# Altium project FAN_PCB(26Pin).PrjPcb
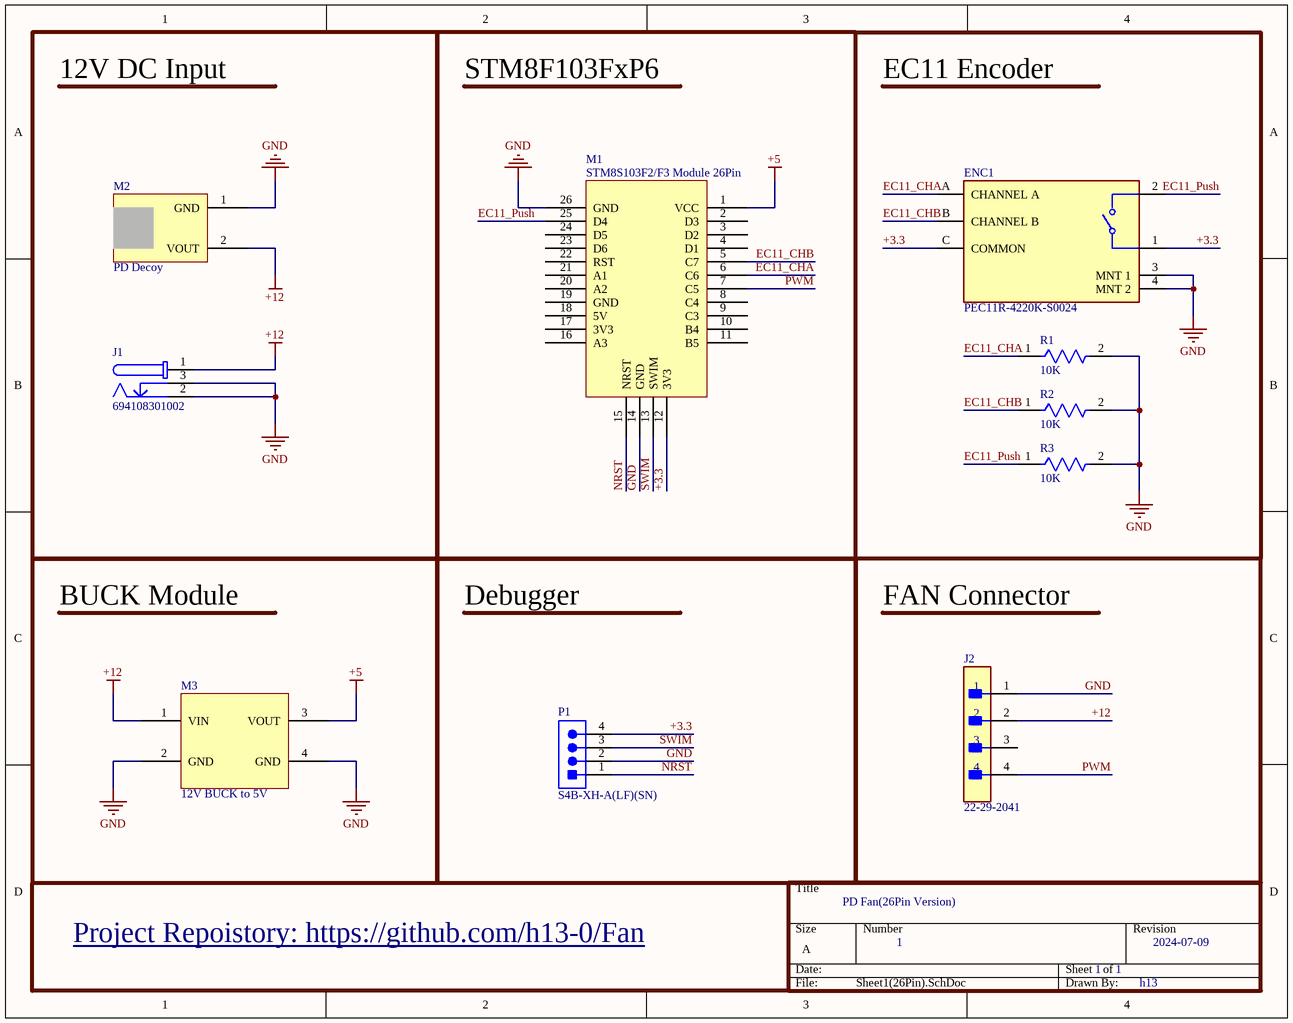
[diagram p0: Sheet1(26Pin).SchDoc]
1 sheet, 10 parts. Net scope: global (net labels, ports and power ports of the same name join across sheets).
Board file: PCB1(26Pin).PcbDoc

## Sheet Sheet1(26Pin).SchDoc
size A; SheetNumber: 1; SheetTotal: 1

### Parts
ENC1  PEC11R-4220K-S0024  [EC11]
J1  694108301002  [694108301002]
J2  22-29-2041  [FP-22-29-2041-MFG]
M1  STM8S103F2/F3 Module 26Pin  [STM8FxP6 Module 26Pin]
M2  PD Decoy  [PD Decoy]
M3  12V BUCK to 5V  [Buck Mini]
P1  S4B-XH-A(LF)(SN)  [JST-S4B-XH-A(LF)(SN)_V]
R1  10K  [FP-MRS25-MFG]
R2  10K  [FP-MRS25-MFG]
R3  10K  [FP-MRS25-MFG]

### Blocks framed on the sheet
12V DC Input: J1 M2
STM8F103FxP6: M1
EC11 Encoder: ENC1 R1-R3
BUCK Module: M3
Debugger: P1
FAN Connector: J2

### Nets
+5: M1.1(VCC) M3.3(VOUT)
+12: J1.1 J2.2 M2.2(VOUT) M3.1(VIN)
GND: ENC1.3(MNT_1) ENC1.4(MNT_2) J1.2 J1.3 J2.1 M1.14(GND) M1.26(GND) M2.1(GND) M3.2(GND) M3.4(GND) P1.2 R1.2 R2.2 R3.2
+3.3: ENC1.1 ENC1.C(COMMON) M1.12(3V3) P1.4
EC11_CHA: ENC1.A(CHANNEL_A) M1.6(C6) R1.1
EC11_CHB: ENC1.B(CHANNEL_B) M1.5(C7) R2.1
EC11_Push: ENC1.2 M1.25(D4) R3.1
NRST: M1.15(NRST) P1.1
PWM: J2.4 M1.7(C5)
SWIM: M1.13(SWIM) P1.3

Not connected (* = marked no-connect by the designer): J2 3; M1 2(D3) 3(D2) 4(D1) 8(C4) 9(C3) 10(B4) 11(B5) 16(A3) 17(3V3) 18(5V) 19(GND) 20(A2) 21(A1) 22(RST) 23(D6) 24(D5)

### Notes on the sheet
- PD Fan(26Pin Version)
- Project Repoistory: https://github.com/h13-0/Fan <https://github.com/h13-0/Fan>
- 1
- 2024-07-09
- h13

### Library data of the parts
ENC1 = CMP-07421-000070-1: ROTARY ENCODER INCREMENTAL 24PPR; pin to pad: 1>E 2>D; Pulses per Revolution: 24; Built in Switch: Yes; Number of Channels: 2; Actuator Type: Shaft; Nominal Supply Voltage (DC): 5V; Output Type: Quadrature; Hole Diameter: 1mm; Min Operating Temperature: -30°C; REACH SVHC: No SVHC; Detent: Yes; Mount: Through Hole; Termination: PC Pin; Max Operating Temperature: 70°C; Height: 13.4mm; Length: 26.5mm; RoHS Compliant: Yes; Number of Pins: 5; Width: 12.5mm; Orientation: Vertical; Packaging: Bulk; Series: PEC11R; Encoder Type: Incremental; Package Quantity: 75
J1 = CMP-1502-00190-3: NexarPartId: 52676102; Gender: Male; Voltage Rating: 24V; Insulation Resistance: 100MΩ; Voltage Rating (DC): 20V; Shielding: Unshielded; Connector Type: Power; Current Rating: 5A; Number of Contacts: 3; Packaging: Bulk; Operating Supply Voltage: 24V; Flammability Rating: UL94 V-0; Housing Material: Polyamide; Color: Black; REACH SVHC: Unknown; Contact Material: Gold, Tin; Max Operating Temperature: 85°C; Contact Gender: Female; Contact Plating: Tin; Termination: Through Hole; Min Operating Temperature: -40°C; RoHS: Compliant; Height: 11mm; Mount: Through Hole
J2 = CMP-04776-000366-1: CONN HEADER VERT 4POS 2.54MM; Insulation Resistance: 50GR; Voltage Rating: 250V; Glow Wire Compliant: Non-compliant; Max Current Rating: 4A; Number of Circuits: 4; Contact Resistance: 10mR; Gender: Male; Number of Lines: 1; Length: 10.16mm; Radiation Hardening: No; Pitch: 2.54mm; Contact Material: Brass; Height: 11.7mm; Max Operating Temperature: 75°C; Flammability Rating: UL94 V-0; Mount: Through Hole; Voltage Rating (DC): 250V; Halogen Free: Low Halogen; Housing Color: White; Package Quantity: 1500; Series: KK® 6410; Number of Rows: 1; Housing Material: Nylon; Depth: 5.8mm; RoHS Compliant: Yes; Orientation: Straight; Contact Gender: Male; Color: Natural; Current Rating: 4A; Contact Mating Length: 0.295inch; Number of Poles: 4; Packaging: Bulk; Contact Type: Male Pin; Termination: Solder; Number of Positions: 4; Number of Contacts: 4; Lead Free: Lead Free; Min Operating Temperature: 0°C; Fastening Type: Friction; Contact Plating: Gold
M1 = STM8S103F2/F3 Module
M3 = BUCK | BOOST: pin to pad: 1>3 3>1 4>2
P1 = CMP-1755-00007-1: Male Header, Pitch 2.5 mm, 1 x 4 Position, Height 6.1 mm, Tail Length 3.4 mm, -25 to 85 degC, RoHS, Bulk; PackageReference: S4B-XH-A(LF)(SN); ComponentLink1Description: Manufacturer URL; DatasheetVersion: May-16; ComponentLink2Description: Datasheet; ComponentLink2URL: http://www.jst-mfg.com/product/pdf/eng/eXH.pdf; ComponentLink1URL: http://www.jst.com/home2.html; PackageDescription: Male Header, Pitch 2.5 mm, 1 x 4 Position, Height 6.1 mm, Tail Length 3.4 mm
R1-R3 = CMP-02408-000051-1: RES 1K OHM 0.6W 1% AXIAL; Power Rating: 600mW; Lead Diameter: 0.6mm; Voltage Rating (DC): 350V; Resistance: 1kR; Temperature Coefficient: 50ppm/°C; Width: 2.5mm; Military Standard: Not; Package Quantity: 5000; Radiation Hardening: No; Case/Package: Axial; Resistance Tolerance: 1%; Resistor Type: Metal Film; Contact Plating: Tin; Length: 6.5mm; Lead Free: Lead Free; RoHS Compliant: Yes; Mount: Through Hole; Number of Pins: 2; Technology: THIN FILM; Voltage Rating: 350V; Min Operating Temperature: -55°C; Weight: 0.00776oz; Diameter: 2.5mm; Construction: Cylindrical; Series: MRS25; Tolerance: 1%; Packaging: Tape and Reel; Max Operating Temperature: 155°C; Max Power Dissipation: 600mW; Number of Terminations: 2; Termination: Axial